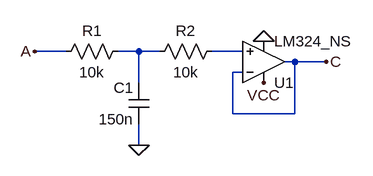
[diagram p0: schematic Draft2.asc]
Draft2.asc, the LTspice schematic file:
Version 4
SHEET 1 880 680
WIRE 0 -16 -48 -16
WIRE 112 -16 80 -16
WIRE 144 -16 112 -16
WIRE 272 -16 224 -16
WIRE 352 0 336 0
WIRE 400 0 352 0
WIRE 272 16 256 16
WIRE 112 32 112 -16
WIRE 256 80 256 16
WIRE 352 80 352 0
WIRE 352 80 256 80
WIRE 112 128 112 96
FLAG 304 -32 0
FLAG 304 32 VCC
FLAG -48 -16 A
FLAG 400 0 C
FLAG 112 128 0
SYMBOL EXTRA\\ExtraOpamps\\LM324_NS 304 0 M180
SYMATTR InstName U1
SYMBOL res -16 0 R270
WINDOW 0 32 56 VTop 2
WINDOW 3 0 56 VBottom 2
SYMATTR InstName R1
SYMATTR Value 10k
SYMBOL cap 128 96 R180
WINDOW 0 24 56 Left 2
WINDOW 3 24 8 Left 2
SYMATTR InstName C1
SYMATTR Value 150n
SYMBOL res 128 0 R270
WINDOW 0 32 56 VTop 2
WINDOW 3 0 56 VBottom 2
SYMATTR InstName R2
SYMATTR Value 10k

The netlist it stands for:
* Draft2.asc
* U1: LM324_NS (symbol EXTRA\ExtraOpamps\LM324_NS not available, pins judged from their places): In+=N002 In-=C V+=VCC V-=0 OUT=C
R1 A N001 10k
C1 0 N001 150n
R2 N001 N002 10k
.backanno
.end